# EAGLE design schematic (EAGLE 6.4)
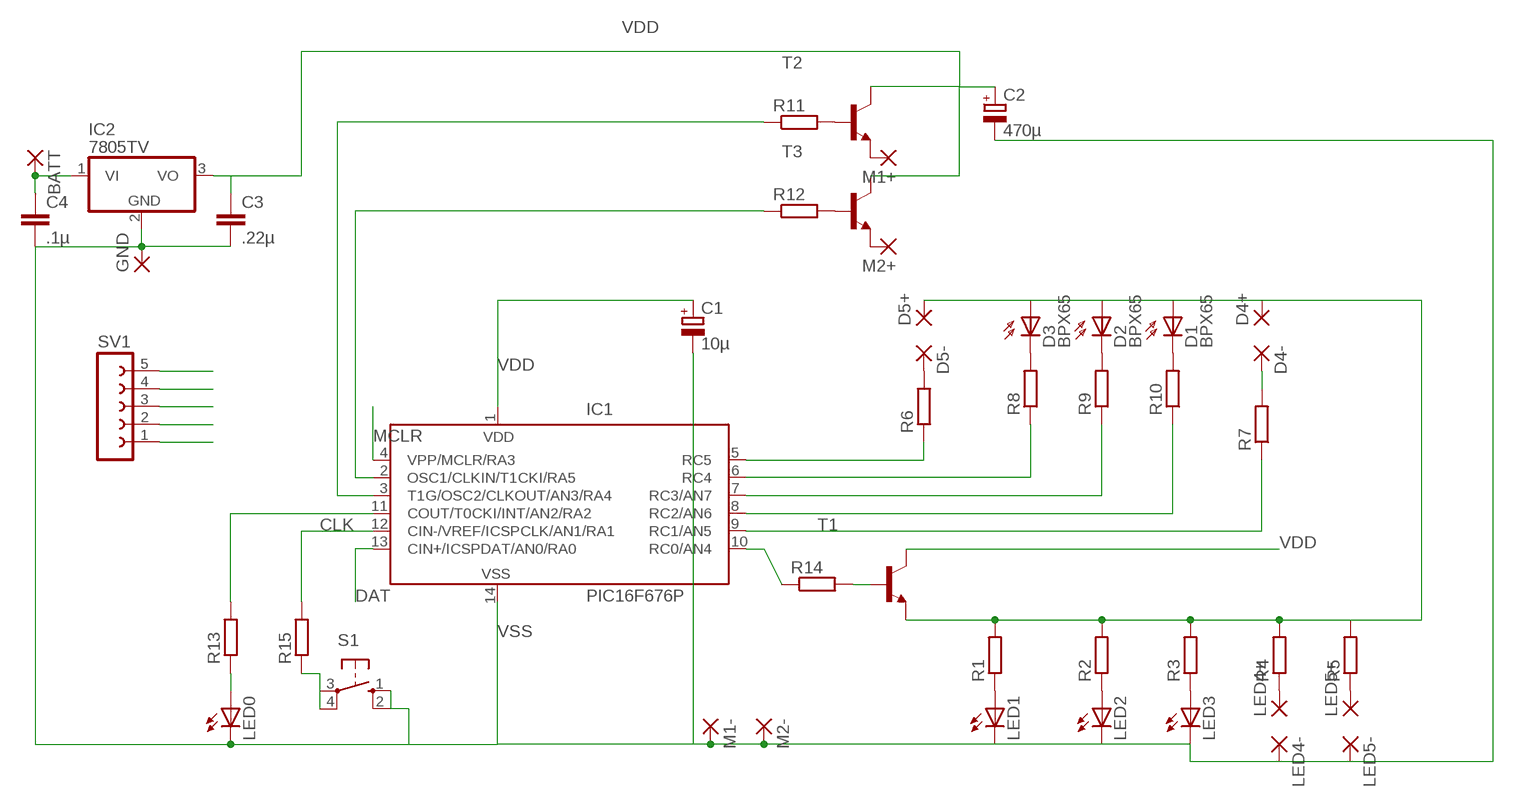
[diagram p0: schematic, sheet 1]

## Parts
BATT  2,15/1,0  [2,15/1,0]
C1  10µ  CPOL-EUE2.5-5  [E2,5-5]
C2  470µ  CPOL-EUE2.5-7  [E2,5-7]
C3  .22µ  C-EU050-025X075  [C050-025X075]
C4  .1µ  C-EU050-025X075  [C050-025X075]
D1  BPX65  [BPX65]
D2  BPX65  [BPX65]
D3  BPX65  [BPX65]
D4+  2,15/1,0  [2,15/1,0]
D4-  2,15/1,0  [2,15/1,0]
D5+  2,15/1,0  [2,15/1,0]
D5-  2,15/1,0  [2,15/1,0]
GND  2,15/1,0  [2,15/1,0]
IC1  PIC16F676P  [DIL14]
IC2  7805TV  [TO220V]
LED0  LED3MM  [LED3MM]
LED1  LED3MM  [LED3MM]
LED2  LED3MM  [LED3MM]
LED3  LED3MM  [LED3MM]
LED4+  2,15/1,0  [2,15/1,0]
LED4-  2,15/1,0  [2,15/1,0]
LED5+  2,15/1,0  [2,15/1,0]
LED5-  2,15/1,0  [2,15/1,0]
M1+  2,15/1,0  [2,15/1,0]
M1-  2,15/1,0  [2,15/1,0]
M2+  2,15/1,0  [2,15/1,0]
M2-  2,15/1,0  [2,15/1,0]
R1  R-EU_0204/7  [0204/7]
R2  R-EU_0204/7  [0204/7]
R3  R-EU_0204/7  [0204/7]
R4  R-EU_0204/7  [0204/7]
R5  R-EU_0204/7  [0204/7]
R6  R-EU_0204/7  [0204/7]
R7  R-EU_0204/7  [0204/7]
R8  R-EU_0204/7  [0204/7]
R9  R-EU_0204/7  [0204/7]
R10  R-EU_0204/7  [0204/7]
R11  R-EU_0204/7  [0204/7]
R12  R-EU_0204/7  [0204/7]
R13  R-EU_0204/7  [0204/7]
R14  R-EU_0204/7  [0204/7]
R15  R-EU_0204/7  [0204/7]
S1  10-XX  [B3F-10XX]
SV1  FE05-1  [FE05-1]
T1  -NPN-TO92  [TO92]
T2  -NPN-TO92  [TO92]
T3  -NPN-TO92  [TO92]

## Nets
CLK: IC1.12(CIN-/VREF/ICSPCLK/AN1/RA1) R15.2 SV1.5
DAT: IC1.13(CIN+/ICSPDAT/AN0/RA0) SV1.4
MCLR: IC1.4(VPP/MCLR/RA3) SV1.1
N$1: D1.A D2.A D3.A D4+.1(P) D5+.1(P) R1.2 R2.2 R3.2 R4.2 R5.2 T1.1(E)
N$2: LED1.A R1.1
N$3: LED2.A R2.1
N$4: LED3.A R3.1
N$5: LED4+.1(P) R4.1
N$6: LED5+.1(P) R5.1
N$7: LED0.A R13.1
N$8: IC1.10(RC0/AN4) R14.1
N$9: R14.2 T1.2(B)
N$10: IC1.6(RC4) R8.1
N$11: D5-.1(P) R6.2
N$12: D4-.1(P) R7.2
N$13: D3.K(C) R8.2
N$14: D2.K(C) R9.2
N$15: D1.K(C) R10.2
N$16: IC1.5(RC5) R6.1
N$17: IC1.7(RC3/AN7) R9.1
N$18: IC1.8(RC2/AN6) R10.1
N$19: IC1.9(RC1/AN5) R7.1
N$21: BATT.1(P) C4.1 IC2.1(VI)
N$24: IC1.11(COUT/T0CKI/INT/AN2/RA2) R13.2
N$25: M1+.1(P) T2.1(E)
N$26: M2+.1(P) T3.1(E)
N$27: R12.2 T3.2(B)
N$28: R11.2 T2.2(B)
N$29: IC1.2(OSC1/CLKIN/T1CKI/RA5) R12.1
N$30: IC1.3(T1G/OSC2/CLKOUT/AN3/RA4) R11.1
N$31: R15.1 S1.3(P) S1.4(P1)
VDD: C1.+ C2.+ C3.1 IC1.1(VDD) IC2.3(VO) SV1.2 T1.3(C) T2.3(C) T3.3(C)
VSS: C1.- C2.- C3.2 C4.2 GND.1(P) IC1.14(VSS) IC2.2(GND) LED0.K(C) LED1.K(C) LED2.K(C) LED3.K(C) LED4-.1(P) LED5-.1(P) M1-.1(P) M2-.1(P) S1.1(S) S1.2(S1) SV1.3

## Library data of the parts
BATT D4+ D4- D5+ D5- GND LED4+ LED4- LED5+ LED5- M1+ M1- M2+ M2- = wirepad:2,15/1,0: THROUGH-HOLE PAD
C1 C2 = resistor:CPOL-EU: POLARIZED CAPACITOR, European symbol
C3 C4 = resistor:C-EU: CAPACITOR, European symbol
D1-D3 = opto-trans-siemens:BPX65: PHOTO DIODE; MPN: BPX65.; OC_FARNELL: 327451; OC_NEWARK: 06WX2764
IC1 = microchip:PIC16F676: 14-Pin, Flash-Based 8-Bit CMOS Microcontroller High Performance RISC CPU: * Only 35 instructions to learn - All single-cycle instructions except branches * Operating speed: - DC - 20 MHz oscillator/clock input - DC - 200 ns instruction cycle * Internal and external oscillator options - Precision Internal 4 MHz oscillator factory calibrated to ±1% - External Oscillator support for crystals and resonators - 5?s wake-up from SLEEP, 3.0V, typical * Power saving SLEEP mode * Wide operating voltage range - 2.0V to 5.5V * Industrial and Extended temperature range * Low power Power-on Reset (POR) * Power-up Timer (PWRT) and Oscillator Start-up Timer (OST) * Brown-out Detect (BOD) * Watchdog Timer (WDT) with independent oscillator for reliable operation * Multiplexed MCLR/Input-pin * Interrupt-on-pin change * Individual programmable weak pull-ups * Programmable code protection * High Endurance FLASH/EEPROM Cell - 100,000 write FLASH endurance - 1,000,000 write EEPROM endurance - FLASH/Data EEPROM Retention: > 40 years * Standby Current: - 1 nA @ 2.0V, typical * Operating Current: - 8.5?A @ 32 kHz, 2.0V, typical - 100?A @ 1 MHz, 2.0V, typical * Watchdog Timer Current - 300 nA @ 2.0V, typical * Timer1 oscillator current: - 4?A @ 32 kHz, 2.0V, typical * 12 I/O pins with individual direction control * High current sink/source for direct LED drive * Analog-to-Digital Converter module (PIC16F676): - 10-bit resolution - Programmable 8-channel input - Voltage reference input * In-Circuit Serial ProgrammingTM (ICSPTM) via two pins Source: http://ww1.microchip.com/downloads/en/DeviceDoc/40039E.pdf; MF: MICROCHIP; MPN: PIC16F676-I/P; OC_FARNELL: 9760512; OC_NEWARK: 54K2829
IC2 = linear:78*: Positive VOLTAGE REGULATOR Source: http://cache.national.com/ds/LM/LM78L05.pdf http://www.fairchildsemi.com/ds/LM/LM7805.pdf
LED0 LED1-LED3 = led:LED: LED OSRAM: - CHIPLED LG R971, LG N971, LY N971, LG Q971, LY Q971, LO R971, LY R971 LH N974, LH R974 LS Q976, LO Q976, LY Q976 LO Q996 - Hyper CHIPLED LW Q18S LB Q993, LB Q99A, LB R99A - SideLED LS A670, LO A670, LY A670, LG A670, LP A670 LB A673, LV A673, LT A673, LW A673 LH A674 LY A675 LS A676, LA A676, LO A676, LY A676, LW A676 LS A679, LY A679, LG A679 - Hyper Micro SIDELED® LS Y876, LA Y876, LO Y876, LY Y876 LT Y87S - SmartLED LW L88C, LW L88S LB L89C, LB L89S, LG L890 LS L89K, LO L89K, LY L89K LS L896, LA L896, LO L896, LY L896 - TOPLED LS T670, LO T670, LY T670, LG T670, LP T670 LSG T670, LSP T670, LSY T670, LOP T670, LYG T670 LG T671, LOG T671, LSG T671 LB T673, LV T673, LT T673, LW T673 LH T674 LS T676, LA T676, LO T676, LY T676, LB T676, LH T676, LSB T676, LW T676 LB T67C, LV T67C, LT T67C, LS T67K, LO T67K, LY T67K, LW E67C LS E67B, LA E67B, LO E67B, LY E67B, LB E67C, LV E67C, LT E67C LW T67C LS T679, LY T679, LG T679 LS T770, LO T770, LY T770, LG T770, LP T770 LB T773, LV T773, LT T773, LW T773 LH T774 LS E675, LA E675, LY E675, LS T675 LS T776, LA T776, LO T776, LY T776, LB T776 LHGB T686 LT T68C, LB T68C - Hyper Mini TOPLED® LB M676 - Mini TOPLED Santana® LG M470 LS M47K, LO M47K, LY M47K Source: http://www.osram.convergy.de LUXEON: - LUMILED® LXK2-PW12-R00, LXK2-PW12-S00, LXK2-PW14-U00, LXK2-PW14-V00 LXK2-PM12-R00, LXK2-PM12-S00, LXK2-PM14-U00 LXK2-PE12-Q00, LXK2-PE12-R00, LXK2-PE12-S00, LXK2-PE14-T00, LXK2-PE14-U00 LXK2-PB12-K00, LXK2-PB12-L00, LXK2-PB12-M00, LXK2-PB14-N00, LXK2-PB14-P00, LXK2-PB14-Q00 LXK2-PR12-L00, LXK2-PR12-M00, LXK2-PR14-Q00, LXK2-PR14-R00 LXK2-PD12-Q00, LXK2-PD12-R00, LXK2-PD12-S00 LXK2-PH12-R00, LXK2-PH12-S00 LXK2-PL12-P00, LXK2-PL12-Q00, LXK2-PL12-R00 Source: www.luxeon.com KINGBRIGHT: KA-3528ASYC Source: www.kingbright.com
R1-R15 = resistor:R-EU_: RESISTOR, European symbol
S1 = switch-omron:10-XX: OMRON SWITCH; MPN: B3F-1000; OC_FARNELL: 176432; OC_NEWARK: 36M3542
SV1 = con-lsta:FE05-1: FEMALE HEADER; OC_FARNELL: unknown; OC_NEWARK: unknown
T1-T3 = transistor:*-NPN-: NPN Transistror BF959 corrected 2008.03.06

## Board
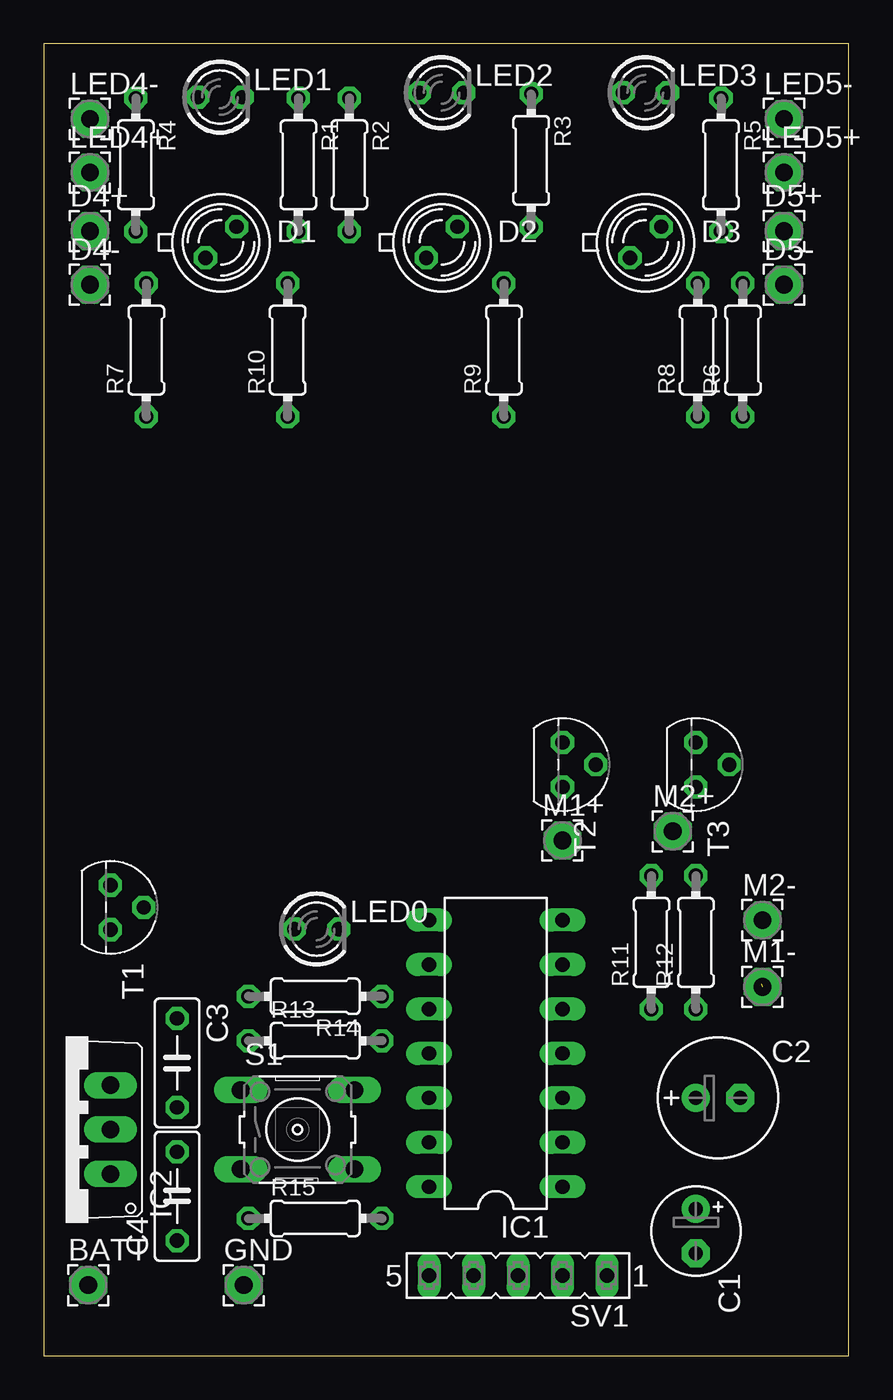
[diagram p1: board, top side]
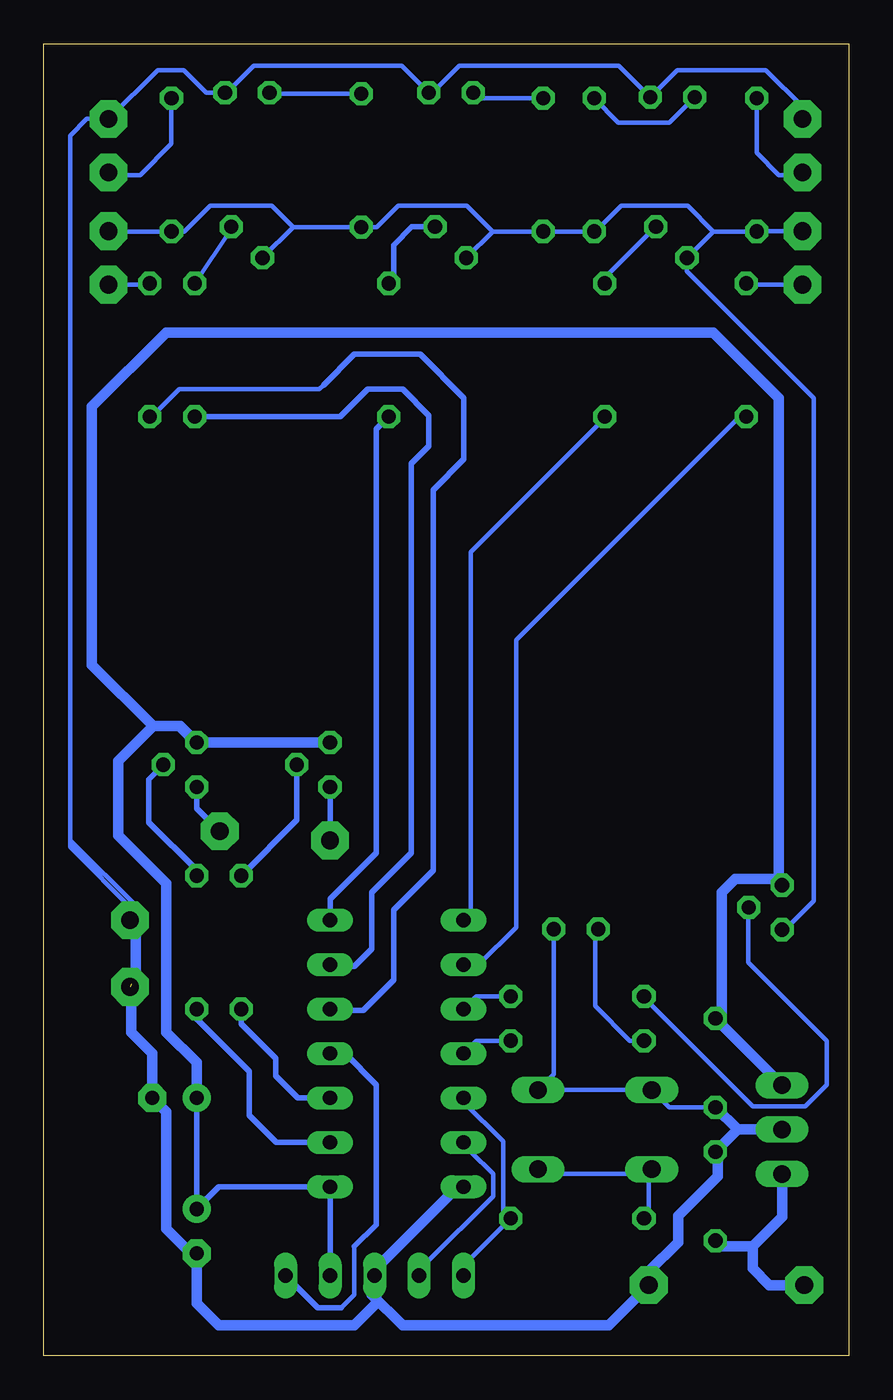
[diagram p2: board, bottom side, seen from below]

Size 46 x 75 mm. Coordinates in mm from the lower left corner, seen from the top.
Outline: 0,0 46,0 46,75 0,75 0,0
Copper layers (1*16): Top 0.035mm / dielectric 1.5mm / Bottom 0.035mm
Design rules "default": minimum track width 10mil, minimum drill 24mil, track to track 8mil, track to pad 8mil, pad to pad 8mil, via to via 8mil, smd to smd 8mil, copper to edge 40mil, drill to drill 8mil, minimum pad ring 10mil, minimum via ring 8mil, stop-mask expansion 4mil, vias tented up to drill 0mil, thermal gap 10mil

### Footprints (pad centres in the part's own frame; a part is rotated, then mirrored left to right if it is on the bottom)
2,15/1,0 = drill 1.016 pad 2.159 octagon: 1 0,0
E2,5-5 = drill 0.813 pad 1.6: + -1.27,0 | drill 0.813 pad 1.6 octagon: - 1.27,0
E2,5-7 = drill 0.813 pad 1.6: + -1.27,0 | drill 0.813 pad 1.6 octagon: - 1.27,0
C050-025X075 = drill 0.813 octagon: 1 -2.54,0; 2 2.54,0
BPX65 = drill 0.813 octagon: A -0.889,-0.889; K 0.889,0.889
DIL14 = drill 0.813 long: 1 -7.62,-3.81; 2 -5.08,-3.81; 3 -2.54,-3.81; 4 0,-3.81; 5 2.54,-3.81; 6 5.08,-3.81; 7 7.62,-3.81; 8 7.62,3.81; 9 5.08,3.81; 10 2.54,3.81; 11 0,3.81; 12 -2.54,3.81; 13 -5.08,3.81; 14 -7.62,3.81
TO220V = drill 1.016 long: 1 -2.54,-2.54; 2 0,-2.54; 3 2.54,-2.54
LED3MM = drill 0.813 octagon: A -1.27,0; K 1.27,0
0204/7 = drill 0.813 octagon: 1 -3.81,0; 2 3.81,0
B3F-10XX = drill 1.016 long: 1 -3.251,2.261; 2 3.251,2.261; 3 -3.251,-2.261; 4 3.251,-2.261
FE05-1 = drill 0.813 long: 1 -5.08,0; 2 -2.54,0; 3 0,0; 4 2.54,0; 5 5.08,0
TO92 = drill 0.813 octagon: 1 1.27,0; 2 0,1.905; 3 -1.27,0

### Placement (x,y rotation side)
BATT  2.54,4.04 0 top
C1  37.26,7.12 270 top
C2  38.53,14.74 0 top
C3  7.62,16.74 270 top
C4  7.62,9.12 90 top
D1  10.13,63.65 0 top
D2  22.75,63.65 0 top
D3  34.39,63.65 0 top
D4+  2.64,64.29 0 top
D4-  2.64,61.23 0 top
D5+  42.3,64.29 0 top
D5-  42.3,61.23 0 top
GND  11.43,4.04 0 top
IC1  25.83,17.28 90 top
IC2  1.27,12.93 90 top
LED0  15.59,24.39 0 top
LED1  10.07,71.95 0 top
LED2  22.73,72.2 0 top
LED3  34.37,72.2 0 top
LED4+  2.64,67.64 0 top
LED4-  2.64,70.7 0 top
LED5+  42.3,67.64 0 top
LED5-  42.3,70.7 0 top
M1+  29.64,29.46 0 top
M1-  41.07,21.09 0 top
M2+  35.95,29.98 0 top
M2-  41.07,24.9 0 top
R1  14.55,68.08 270 top
R2  17.46,68.08 270 top
R3  27.85,68.33 270 top
R4  5.26,68.08 270 top
R5  38.7,68.08 270 top
R6  39.95,57.49 90 top
R7  5.86,57.49 90 top
R8  37.37,57.49 90 top
R9  26.29,57.49 90 top
R10  13.94,57.49 90 top
R11  34.72,23.63 90 top
R12  37.26,23.63 90 top
R13  15.51,18.01 0 top
R14  15.51,20.55 180 top
R15  15.51,7.85 0 top
S1  14.51,12.93 0 top
SV1  27.1,4.58 180 top
T1  3.81,25.63 270 top
T2  29.64,33.79 270 top
T3  37.26,33.79 270 top

### Tracks (layer width: path | path; a pad name or v marks a point on that pad's centre or on a via)
CLK
  Bottom 0.254: SV1.5 22.02,5.15 R15.2 19.75,8.28 19.75,12.25 22.02,14.52 IC1.12
DAT
  Bottom 0.254: IC1.13 21.59,11.66 20.32,10.39 20.32,9.12 24.13,5.31 SV1.4
MCLR
  Bottom 0.254: 29,2.75 28.25,3.5 28.25,6.25
  Bottom 0.305: IC1.4 28.78,17.28 27,15.5 27,7.5 28.25,6.25 | 29,2.75 30.35,2.75 SV1.1
N$1
  Bottom 0.254: D4+.1 5.24,64.29 R4.2 7.73,64.27 | 7.73,64.27 D1.A 9.25,62 2,54.75 2,26 3.64,24.36 T1.1 | 20.35,64.27 R2.2 R1.2 14.48,64.27 13,65.75 9.21,65.75 7.73,64.27 | 20.35,64.27 D2.A | 20.35,64.27 21.83,65.75 25.75,65.75 26.98,64.52 R3.2 31.74,64.52 | 31.74,64.52 D3.A | D5+.1 42.28,64.27 R5.2 37.98,64.27 36.5,65.75 32.97,65.75 31.74,64.52
N$2
  Bottom 0.254: LED1.A 10.25,70.5 13.16,70.5 R1.1
N$3
  Bottom 0.254: R2.1 21.15,71.89 LED2.A
N$4
  Bottom 0.254: R3.1 33.04,72.14 LED3.A
N$5
  Bottom 0.254: R4.1 5.26,68.76 4,67.5 2.78,67.5 LED4+.1
N$6
  Bottom 0.254: R5.1 38.7,69.3 40.5,67.5 42.16,67.5 LED5+.1
N$7
  Bottom 0.254: R13.1 12.51,18.01 14.5,20 14.5,24.21 LED0.A
N$8
  Bottom 0.254: 19.05,20.55 R14.1 21.29,20.55 IC1.10
N$9
  Bottom 0.254: T1.2 5.75,25.59 5.75,22.5 1.25,18 1.25,15.5 2.5,14.25 5.5,14.25 11.7,20.45 R14.2
N$10
  Bottom 0.305: R8.1 29.07,53.68 27.5,55.25 25.5,55.25 24,53.75 24,52 25,51 25,28.75 27.25,26.5 27.25,23.25 28.25,22.25 29.53,22.25 IC1.6
N$11
  Bottom 0.254: D5-.1 40.02,61.23 R6.2
N$12
  Bottom 0.254: D4-.1 5.79,61.23 R7.2
N$13
  Bottom 0.254: D3.K 35.28,64.39 R8.2
N$14
  Bottom 0.305: D2.K 24.96,64.54 26,63.5 26,61.59 R9.2
N$15
  Bottom 0.254: R10.2 13.94,61.62 D1.K
N$16
  Bottom 0.254: R6.1 39.82,53.68 38.25,55.25 30.25,55.25 30,55.5
  Bottom 0.305: 30,55.5 28.25,57.25 24.5,57.25 22,54.75 22,51.25 23.75,49.5 23.75,27.75 26,25.5 26,21.5 27.75,19.75 29.57,19.75 IC1.5
N$17
  Bottom 0.305: IC1.7 29.64,26.11 27,28.75 27,52.97 R9.1
N$18
  Bottom 0.254: IC1.8 21.59,24.36 21.59,45.95 13.97,53.57 R10.1
N$19
  Bottom 0.254: R7.1 6.35,53.57 19,40.92 19,24.5 21.14,22.36 IC1.9
N$21
  Bottom 0.61: IC2.1 3.81,7.94 5.5,6.25 | 5.5,6.25 7.29,6.25 C4.1 | BATT.1 4.54,4.04 5.5,5 5.5,6.25
N$24
  Bottom 0.254: 19.05,18.01 R13.2 21.29,18.01 IC1.11
N$25
  Bottom 0.305: T2.1 M1+.1
N$26
  Bottom 0.305: T3.1 37.26,31.29 M2+.1
N$27
  Bottom 0.305: R12.2 37.26,27.76 40,30.5 40,32.95 T3.2
N$28
  Bottom 0.305: T2.2 31.55,30.61 R11.2
N$29
  Bottom 0.305: IC1.2 32.7,12.2 34.25,13.75 34.25,16.25 37.25,19.25 R12.1
N$30
  Bottom 0.305: R11.1 34.72,18.97 32.75,17 32.75,16 31.5,14.75 IC1.3
N$31
  Bottom 0.254: 11.43,10.39 11.43,7.85 R15.1 | 11.43,10.39 16.51,10.39 S1.4 | 11.43,10.39 S1.3
VDD
  Bottom 0.305: SV1.2 IC1.1 35.99,9.66 C1.+ C2.+
  Bottom 0.61: IC2.3 C3.1 7.25,19.65 7.25,26.5 6.5,27.25 4.16,27.25 | 4.16,27.25 T1.3 | C2.+ 37.26,16.76 39,18.5 39,27 41.75,29.75 41.75,34 39.75,36 | 38.25,36 38.2,36 T3.3 T2.3 37.31,35.06 38.25,36 | 38.25,36 39.75,36 | 39.75,36 43.25,39.5 43.25,54.25 39,58.5 7.75,58.5 4,54.75 4,27.41 4.16,27.25
VSS  (1 unrouted)
  Bottom 0.254: IC1.14 22.86,9.12 26.67,5.31 SV1.3 | 44.45,29.44 40.64,25.63 40.79,25.38 | 40.79,25.38 M2-.1 | C3.2 10.27,14.2 S1.1 S1.2 16.86,16.09 LED0.K | 40.79,25.38 44.5,29.09 44.5,69.75 43.55,70.7 LED5-.1 39.5,73.5 38,73.5 36.7,72.2 LED3.K 35.55,72.2 34,73.75 25.55,73.75 LED2.K 23.8,72.2 22.25,73.75 13.14,73.75 LED1.K 9.79,73.5 4.75,73.5 2.64,71.39 LED4-.1
  Bottom 0.61: IC2.2 6.35,12.93 | 6.35,12.93 C3.2 | 6.35,12.93 C4.2 7.5,11.54 7.5,10.25 9.75,8 9.75,6.5 11.43,4.82 GND.1 13.72,1.75 25.5,1.75 27.25,3.5 27.25,4.75 22.34,9.66 IC1.14 | SV1.3 27,4.48 27,3 28.25,1.75 36,1.75 37.26,3.01 C1.- 37.6,5.85 39,7.25 39,13.94 C2.- 39.8,17.3 41,18.5 41,21.25 40.75,21.5 40.75,24.58 M2-.1